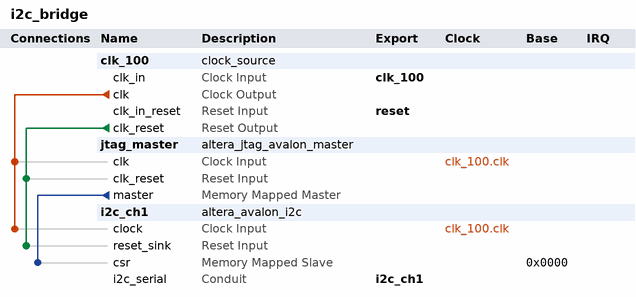
[diagram p0: system contents]
# Platform Designer (Qsys) system i2c_bridge, Arria 10 10AXF40AA
# Parameters at their usual value, and those the tool derives, are not listed.
package require -exact qsys 22.1
create_system i2c_bridge
set_project_property DEVICE_FAMILY {Arria 10}
set_project_property DEVICE 10AXF40AA

add_instance clk_100 clock_source 22.1
set_instance_parameter_value clk_100 clockFrequency 100000000

add_instance jtag_master altera_jtag_avalon_master 22.1

add_instance i2c_ch1 altera_avalon_i2c 22.1
set_instance_parameter_value i2c_ch1 FIFO_DEPTH 4

# connections
add_connection clk_100.clk i2c_ch1.clock clock
add_connection clk_100.clk jtag_master.clk clock
add_connection clk_100.clk_reset i2c_ch1.reset_sink reset
add_connection clk_100.clk_reset jtag_master.clk_reset reset
add_connection jtag_master.master i2c_ch1.csr avalon
set_connection_parameter_value jtag_master.master/i2c_ch1.csr baseAddress 0x0000

# exported interfaces
add_interface clk_100 clock sink
set_interface_property clk_100 EXPORT_OF clk_100.clk_in
add_interface i2c_ch1 conduit end
set_interface_property i2c_ch1 EXPORT_OF i2c_ch1.i2c_serial
add_interface reset reset sink
set_interface_property reset EXPORT_OF clk_100.clk_in_reset

set_interconnect_requirement {$system} qsys_mm.clockCrossingAdapter HANDSHAKE
set_interconnect_requirement {$system} qsys_mm.enableEccProtection FALSE
set_interconnect_requirement {$system} qsys_mm.insertDefaultSlave FALSE
set_interconnect_requirement {$system} qsys_mm.maxAdditionalLatency 1

save_system i2c_bridge.qsys
